# Altium schematic sheet bat_v.SchDoc
size A4
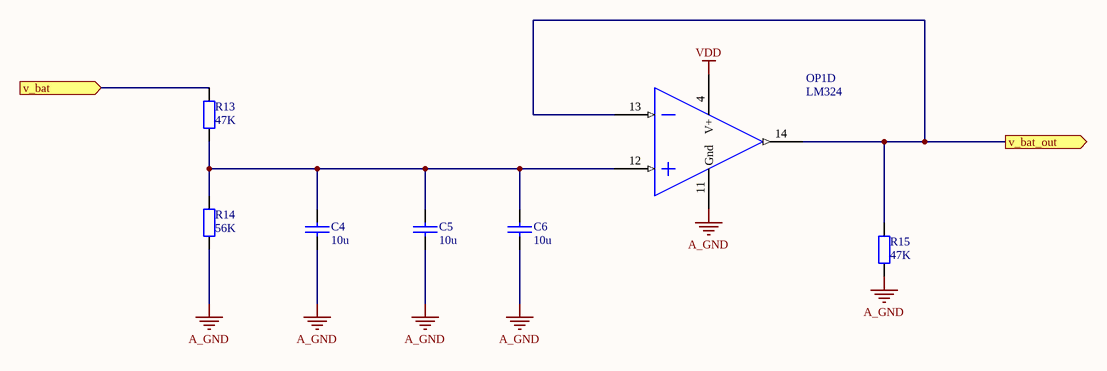
[diagram p0: bat_v.SchDoc]

## Parts
C4  10u
C5  10u
C6  10u
OP1  LM324  (part D of 4)
R13  47K
R14  56K
R15  47K

## Ports
v_bat (in), v_bat_out (out)

## Nets
A_GND: C4.1 C5.1 C6.1 OP1.11(Gnd) R14.1 R15.1
VDD: OP1.4(V+)
v_bat: R13.2 ; port v_bat
v_bat_out: OP1.13(IN4(-)) OP1.14(OUT4) R15.2 ; port v_bat_out
NetC4_2: C4.2 C5.2 C6.2 OP1.12(IN4(+)) R13.1 R14.2

## Library data of the parts
C4-C6 = Cap: Capacitor; Value: *
R13-R15 = Resistor: Value: *